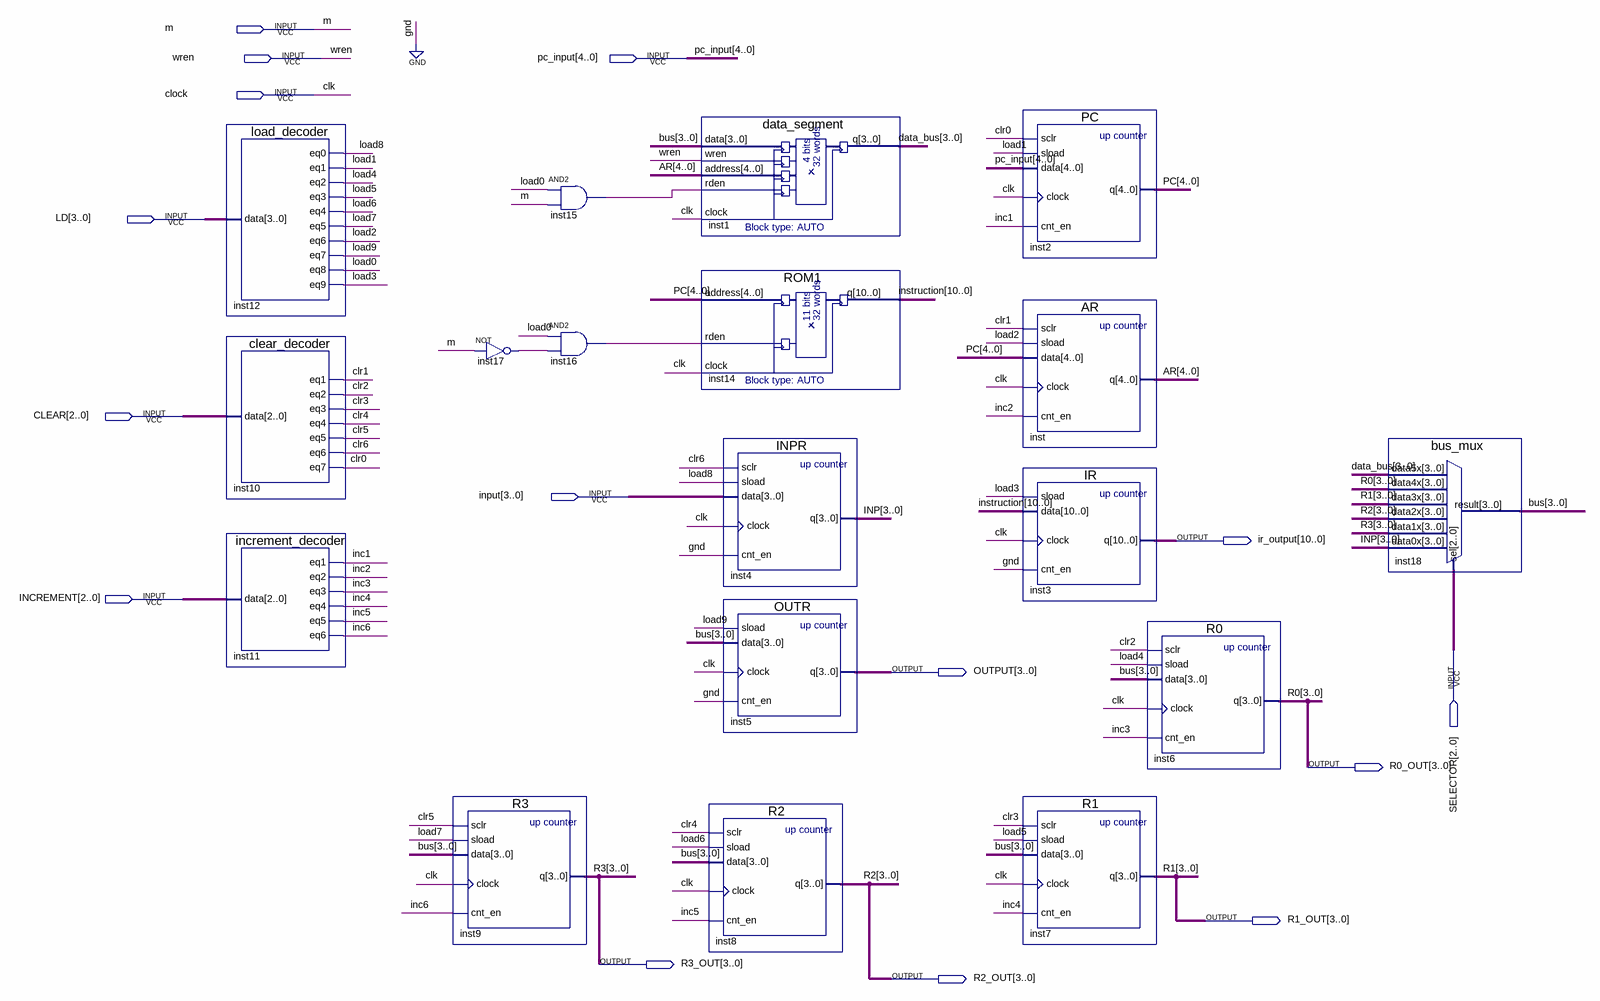
[diagram p0: schematic sheet]
// Quartus schematic Common_Bus_System.bdf as structural Verilog: 18 symbols, 15 pins
module Common_Bus_System (
  input  m,
  input  wren,
  input  [4:0] pc_input,
  input  clock,
  input  [3:0] LD,
  input  [2:0] CLEAR,
  input  [3:0] \input ,
  input  [2:0] INCREMENT,
  input  [2:0] SELECTOR,
  output [10:0] ir_output,
  output [3:0] OUTPUT,
  output [3:0] R0_OUT,
  output [3:0] R1_OUT,
  output [3:0] R3_OUT,
  output [3:0] R2_OUT
);

  wire clr0, clr1, clr2, clr3, clr4, clr5, clr6, inc1, inc2, inc3, inc4, inc5, inc6, inst15_out, inst16_out,
       inst17_out, load0, load1, load2, load3, load4, load5, load6, load7, load8, load9;
  wire [3:0] bus, data_bus, INP;
  wire [4:0] AR, PC;
  wire [10:0] instruction;

  load_decoder inst12 (
    .data(LD), .eq0(load8), .eq1(load1), .eq2(load4), .eq3(load5), .eq4(load6), .eq5(load7), .eq6(load2),
    .eq7(load9), .eq8(load0), .eq9(load3));
  clear_decoder inst10 (
    .data(CLEAR), .eq1(clr1), .eq2(clr2), .eq3(clr3), .eq4(clr4), .eq5(clr5), .eq6(clr6), .eq7(clr0));
  increment_decoder inst11 (.data(INCREMENT), .eq1(inc1), .eq2(inc2), .eq3(inc3), .eq4(inc4), .eq5(inc5), .eq6(inc6));
  R3 inst9 (.sclr(clr5), .sload(load7), .data(bus), .clock(clock), .cnt_en(inc6), .q(R3_OUT));
  not inst17 (inst17_out, m);
  and inst15 (inst15_out, load0, m);
  and inst16 (inst16_out, load0, inst17_out);
  data_segment inst1 (.data(bus), .wren(wren), .address(AR), .rden(inst15_out), .clock(clock), .q(data_bus));
  ROM1 inst14 (.address(PC), .rden(inst16_out), .clock(clock), .q(instruction));
  INPR inst4 (.sclr(clr6), .sload(load8), .data(\input ), .clock(clock), .cnt_en(1'b0), .q(INP));
  OUTR inst5 (.sload(load9), .data(bus), .clock(clock), .cnt_en(1'b0), .q(OUTPUT));
  R2 inst8 (.sclr(clr4), .sload(load6), .data(bus), .clock(clock), .cnt_en(inc5), .q(R2_OUT));
  PC inst2 (.sclr(clr0), .sload(load1), .data(pc_input), .clock(clock), .cnt_en(inc1), .q(PC));
  AR inst (.sclr(clr1), .sload(load2), .data(PC), .clock(clock), .cnt_en(inc2), .q(AR));
  IR inst3 (.sload(load3), .data(instruction), .clock(clock), .cnt_en(1'b0), .q(ir_output));
  R1 inst7 (.sclr(clr3), .sload(load5), .data(bus), .clock(clock), .cnt_en(inc4), .q(R1_OUT));
  R0 inst6 (.sclr(clr2), .sload(load4), .data(bus), .clock(clock), .cnt_en(inc3), .q(R0_OUT));
  bus_mux inst18 (
    .data5x(data_bus), .data4x(R0_OUT), .data3x(R1_OUT), .data2x(R2_OUT), .data1x(R3_OUT), .data0x(INP),
    .sel(SELECTOR), .result(bus));

  // Other names for the same wires on the sheet: clk = clock; R0[3:0] = R0_OUT; R1[3:0] = R1_OUT; R2[3:0] = R2_OUT;
  //   R3[3:0] = R3_OUT
endmodule
